# EAGLE design MAIN_AV_Final_2 (EAGLE 9.6.2)
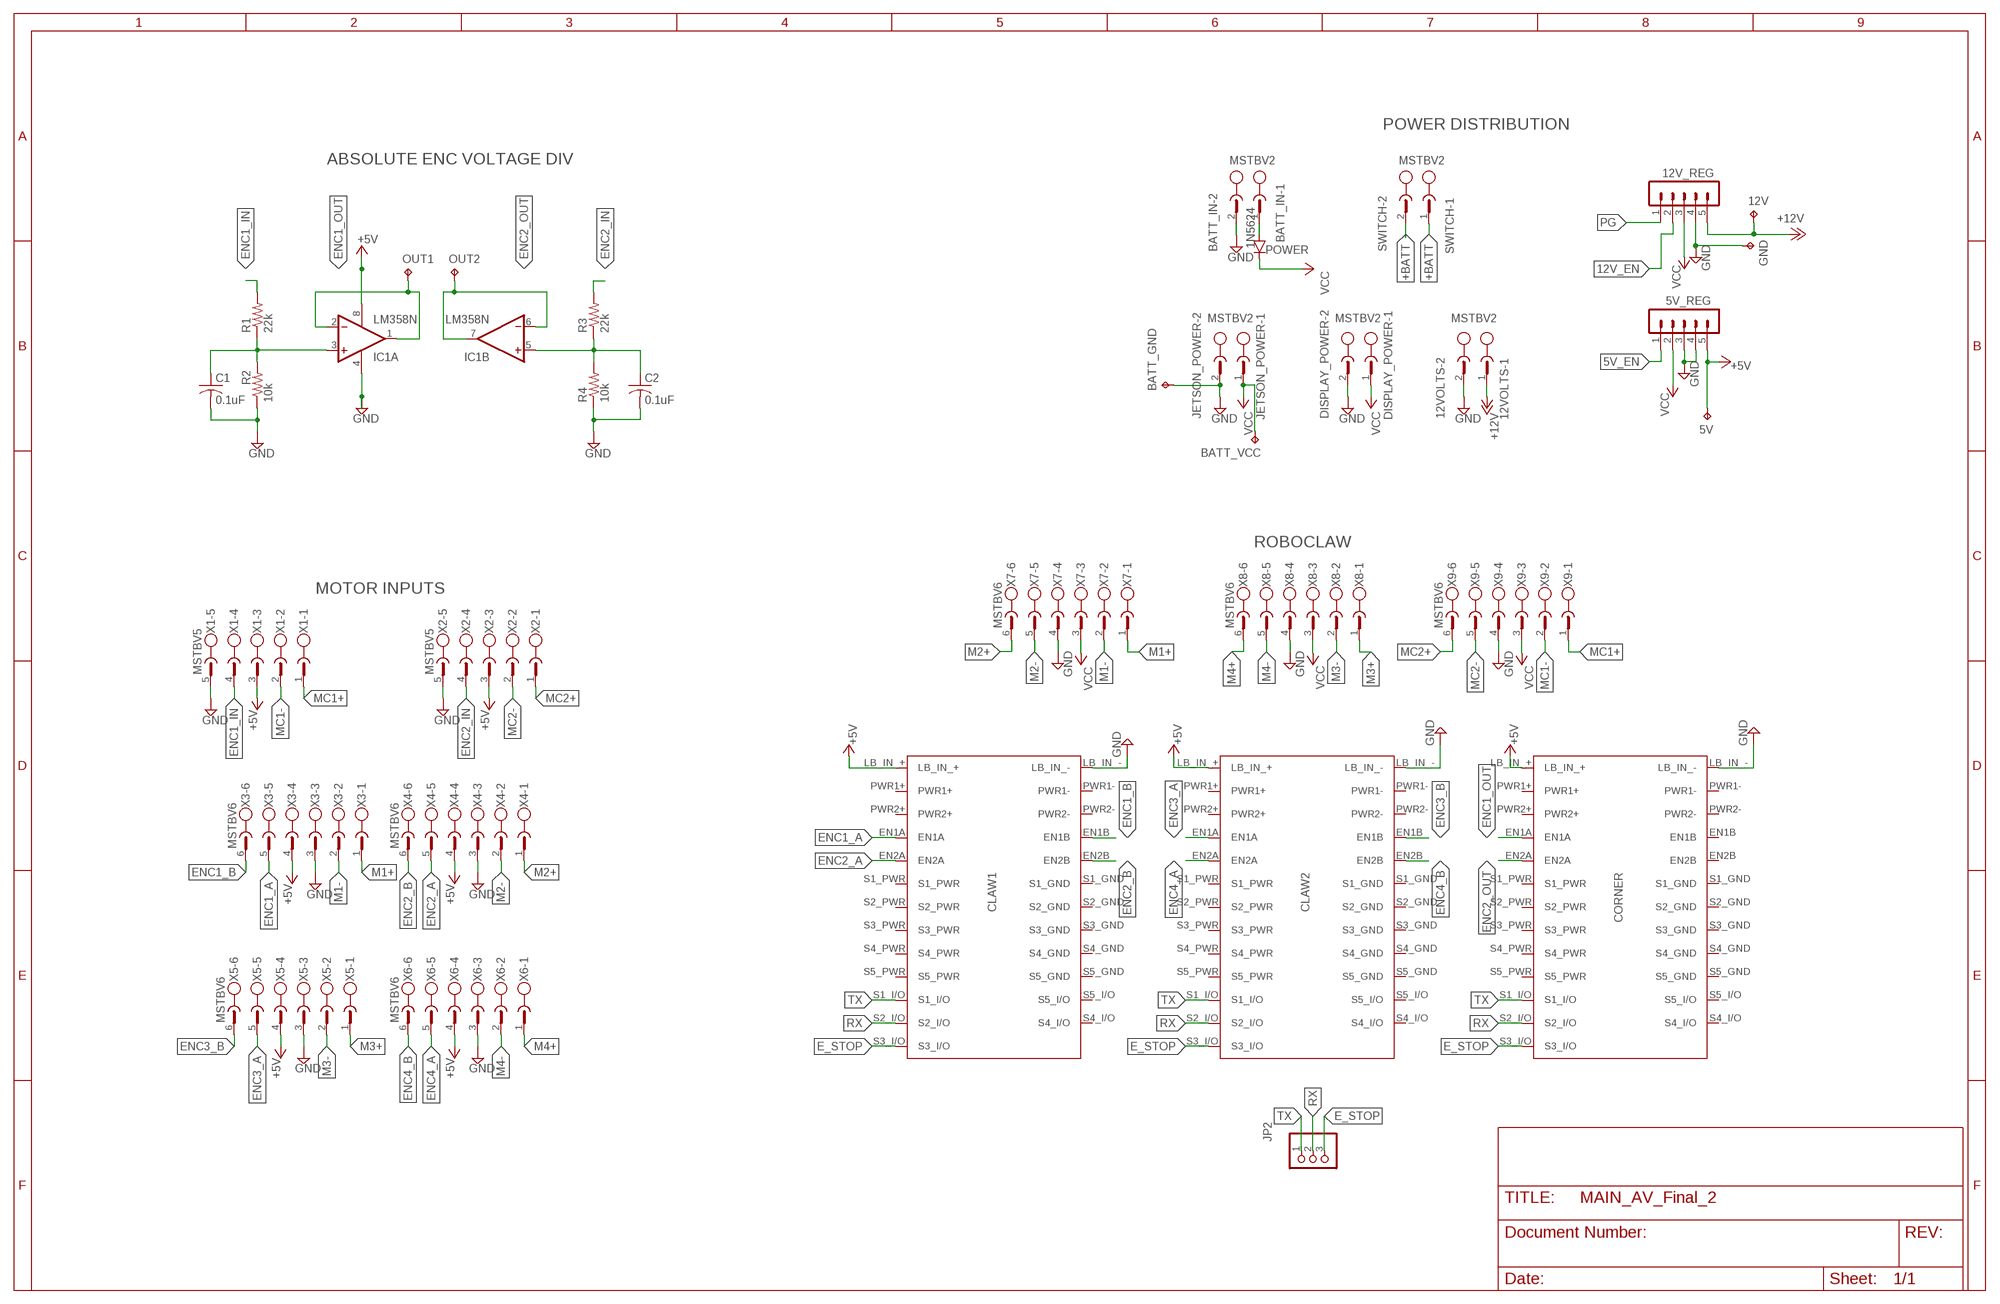
[diagram p0: schematic, sheet 1]

## Parts
5V  TPB1,27  [B1,27]
5V_REG  MA05-1  [MA05-1]
12V  TPB1,27  [B1,27]
12V_REG  MA05-1  [MA05-1]
12VOLTS  MSTBV2  [MSTBV2]
BATT_GND  TPB1,27  [B1,27]
BATT_IN  MSTBV2  [MSTBV2]
BATT_VCC  TPB1,27  [B1,27]
C1  0.1uF  C-US050-024X044  [C050-024X044]
C2  0.1uF  C-US050-024X044  [C050-024X044]
CLAW1  ROBOCLAW2X7A  [ROBOCLAW]
CLAW2  ROBOCLAW2X7A  [ROBOCLAW]
CORNER  ROBOCLAW2X7A  [ROBOCLAW]
DISPLAY_POWER  MSTBV2  [MSTBV2]
GND  TPB1,27  [B1,27]
IC1  LM358N  [DIL08]
JETSON_POWER  MSTBV2  [MSTBV2]
JP2  PINHD-1X3  [1X03]
OUT1  TPB1,27  [B1,27]
OUT2  TPB1,27  [B1,27]
POWER  1N5624  [DO201-15]
R1  22k  R-US_0204/7  [0204/7]
R2  10k  R-US_0204/7  [0204/7]
R3  22k  R-US_0204/7  [0204/7]
R4  10k  R-US_0204/7  [0204/7]
SWITCH  MSTBV2  [MSTBV2]
X1  MSTBV5  [MSTBV5]
X2  MSTBV5  [MSTBV5]
X3  MSTBV6  [MSTBV6]
X4  MSTBV6  [MSTBV6]
X5  MSTBV6  [MSTBV6]
X6  MSTBV6  [MSTBV6]
X7  MSTBV6  [MSTBV6]
X8  MSTBV6  [MSTBV6]
X9  MSTBV6  [MSTBV6]

## Nets
5V_EN: 5V_REG.1
12V_EN [12v_reg]: 12V_REG.2
+5V [power_5v]: 5V.TP 5V_REG.5 CLAW1.LB_IN_+ CLAW2.LB_IN_+ CORNER.LB_IN_+ IC1.8(P:V+) X1.3 X2.3 X3.4 X4.4 X5.4 X6.4
+12V [12v_reg]: 12V.TP 12V_REG.5 12VOLTS.1
+BATT [vcc]: SWITCH.1 SWITCH.2
E_STOP: CLAW1.S3_I/O CLAW2.S3_I/O CORNER.S3_I/O JP2.3
ENC1_A: CLAW1.EN1A X3.5
ENC1_B: CLAW1.EN1B X3.6
ENC1_IN: R1.2 X1.4
ENC1_OUT: CORNER.EN1A IC1.1(A:OUT) IC1.2(A:-IN) OUT1.TP
ENC2_A: CLAW1.EN2A X4.5
ENC2_B: CLAW1.EN2B X4.6
ENC2_IN: R3.2 X2.4
ENC2_OUT: CORNER.EN2A IC1.6(B:-IN) IC1.7(B:OUT) OUT2.TP
ENC3_A: CLAW2.EN1A X5.5
ENC3_B: CLAW2.EN1B X5.6
ENC4_A: CLAW2.EN2A X6.5
ENC4_B: CLAW2.EN2B X6.6
GND [vcc]: 5V_REG.3 5V_REG.4 12V_REG.4 12VOLTS.2 BATT_GND.TP BATT_IN.2 C1.2 C2.2 CLAW1.LB_IN_- CLAW2.LB_IN_- CORNER.LB_IN_- DISPLAY_POWER.2 GND.TP IC1.4(P:V-) JETSON_POWER.2 R2.1 R4.1 X1.5 X2.5 X3.3 X4.3 X5.3 X6.3 X7.4 X8.4 X9.4
M1+ [12v_reg]: X3.1 X7.1
M1- [12v_reg]: X3.2 X7.2
M2+ [12v_reg]: X4.1 X7.6
M2- [12v_reg]: X4.2 X7.5
M3+ [12v_reg]: X5.1 X8.1
M3- [12v_reg]: X5.2 X8.2
M4+ [12v_reg]: X6.1 X8.6
M4- [12v_reg]: X6.2 X8.5
MC1+ [12v_reg]: X1.1 X9.1
MC1- [12v_reg]: X1.2 X9.2
MC2+ [12v_reg]: X2.1 X9.6
MC2- [12v_reg]: X2.2 X9.5
N$1: C1.1 IC1.3(A:+IN) R1.1 R2.2
N$2: C2.1 IC1.5(B:+IN) R3.1 R4.2
N$3 [vcc]: BATT_IN.1 POWER.A
PG: 12V_REG.1
RX: CLAW1.S2_I/O CLAW2.S2_I/O CORNER.S2_I/O JP2.2
TX: CLAW1.S1_I/O CLAW2.S1_I/O CORNER.S1_I/O JP2.1
VCC [vcc]: 5V_REG.2 12V_REG.3 BATT_VCC.TP DISPLAY_POWER.1 JETSON_POWER.1 POWER.C X7.3 X8.3 X9.3
Unconnected: CLAW1.PWR1+ CLAW1.PWR1- CLAW1.PWR2+ CLAW1.PWR2- CLAW1.S1_GND CLAW1.S1_PWR CLAW1.S2_GND CLAW1.S2_PWR CLAW1.S3_GND CLAW1.S3_PWR CLAW1.S4_GND CLAW1.S4_I/O CLAW1.S4_PWR CLAW1.S5_GND CLAW1.S5_I/O CLAW1.S5_PWR CLAW2.PWR1+ CLAW2.PWR1- CLAW2.PWR2+ CLAW2.PWR2- CLAW2.S1_GND CLAW2.S1_PWR CLAW2.S2_GND CLAW2.S2_PWR CLAW2.S3_GND CLAW2.S3_PWR CLAW2.S4_GND CLAW2.S4_I/O CLAW2.S4_PWR CLAW2.S5_GND CLAW2.S5_I/O CLAW2.S5_PWR CORNER.EN1B CORNER.EN2B CORNER.PWR1+ CORNER.PWR1- CORNER.PWR2+ CORNER.PWR2- CORNER.S1_GND CORNER.S1_PWR CORNER.S2_GND CORNER.S2_PWR CORNER.S3_GND CORNER.S3_PWR CORNER.S4_GND CORNER.S4_I/O CORNER.S4_PWR CORNER.S5_GND CORNER.S5_I/O CORNER.S5_PWR

## Notes on the sheet
- POWER DISTRIBUTION
- ABSOLUTE ENC VOLTAGE DIV
- ROBOCLAW
- MOTOR INPUTS

## Library data of the parts
5V 12V BATT_GND BATT_VCC GND OUT1 OUT2 = testpad:TP: Test pad
5V_REG 12V_REG = con-lstb:MA05-1: PIN HEADER; OC_FARNELL: unknown; OC_NEWARK: unknown
12VOLTS BATT_IN DISPLAY_POWER JETSON_POWER SWITCH = con-phoenix-508:MSTBV2: PHOENIX; MPN: MSTBV 2,5/2-GF-5.08; OC_FARNELL: 1792792; OC_NEWARK: 69R9845
C1 C2 = rcl:C-US: CAPACITOR, American symbol; SPICEPREFIX: C
CLAW1 CLAW2 CORNER = Roboclaw_New:ROBOCLAW2X7A
IC1 = linear:LM358: OP AMP also LM158; LM258; LM2904 Source: http://cache.national.com/ds/LM/LM158.pdf
JP2 = pinhead:PINHD-1X3: PIN HEADER
POWER = diode:1N5624: DIODE controlled avalanche rectifier
R1-R4 = rcl:R-US_: RESISTOR, American symbol; SPICEPREFIX: R
X1 X2 = con-phoenix-508:MSTBV5: PHOENIX; MPN: MSTBV 2,5/5-GF-5.08; OC_FARNELL: 1792795; OC_NEWARK: 69R9848
X3-X9 = con-phoenix-508:MSTBV6: PHOENIX; MPN: MSTBV 2,5/6-GF-5.08; OC_FARNELL: 1792796; OC_NEWARK: 69R9849

## Net classes
0 default: width 0.254 mm
1 power_5v: width 0.254 mm
2 12v_reg: width 0.635 mm
3 vcc: width 0.762 mm

## Board
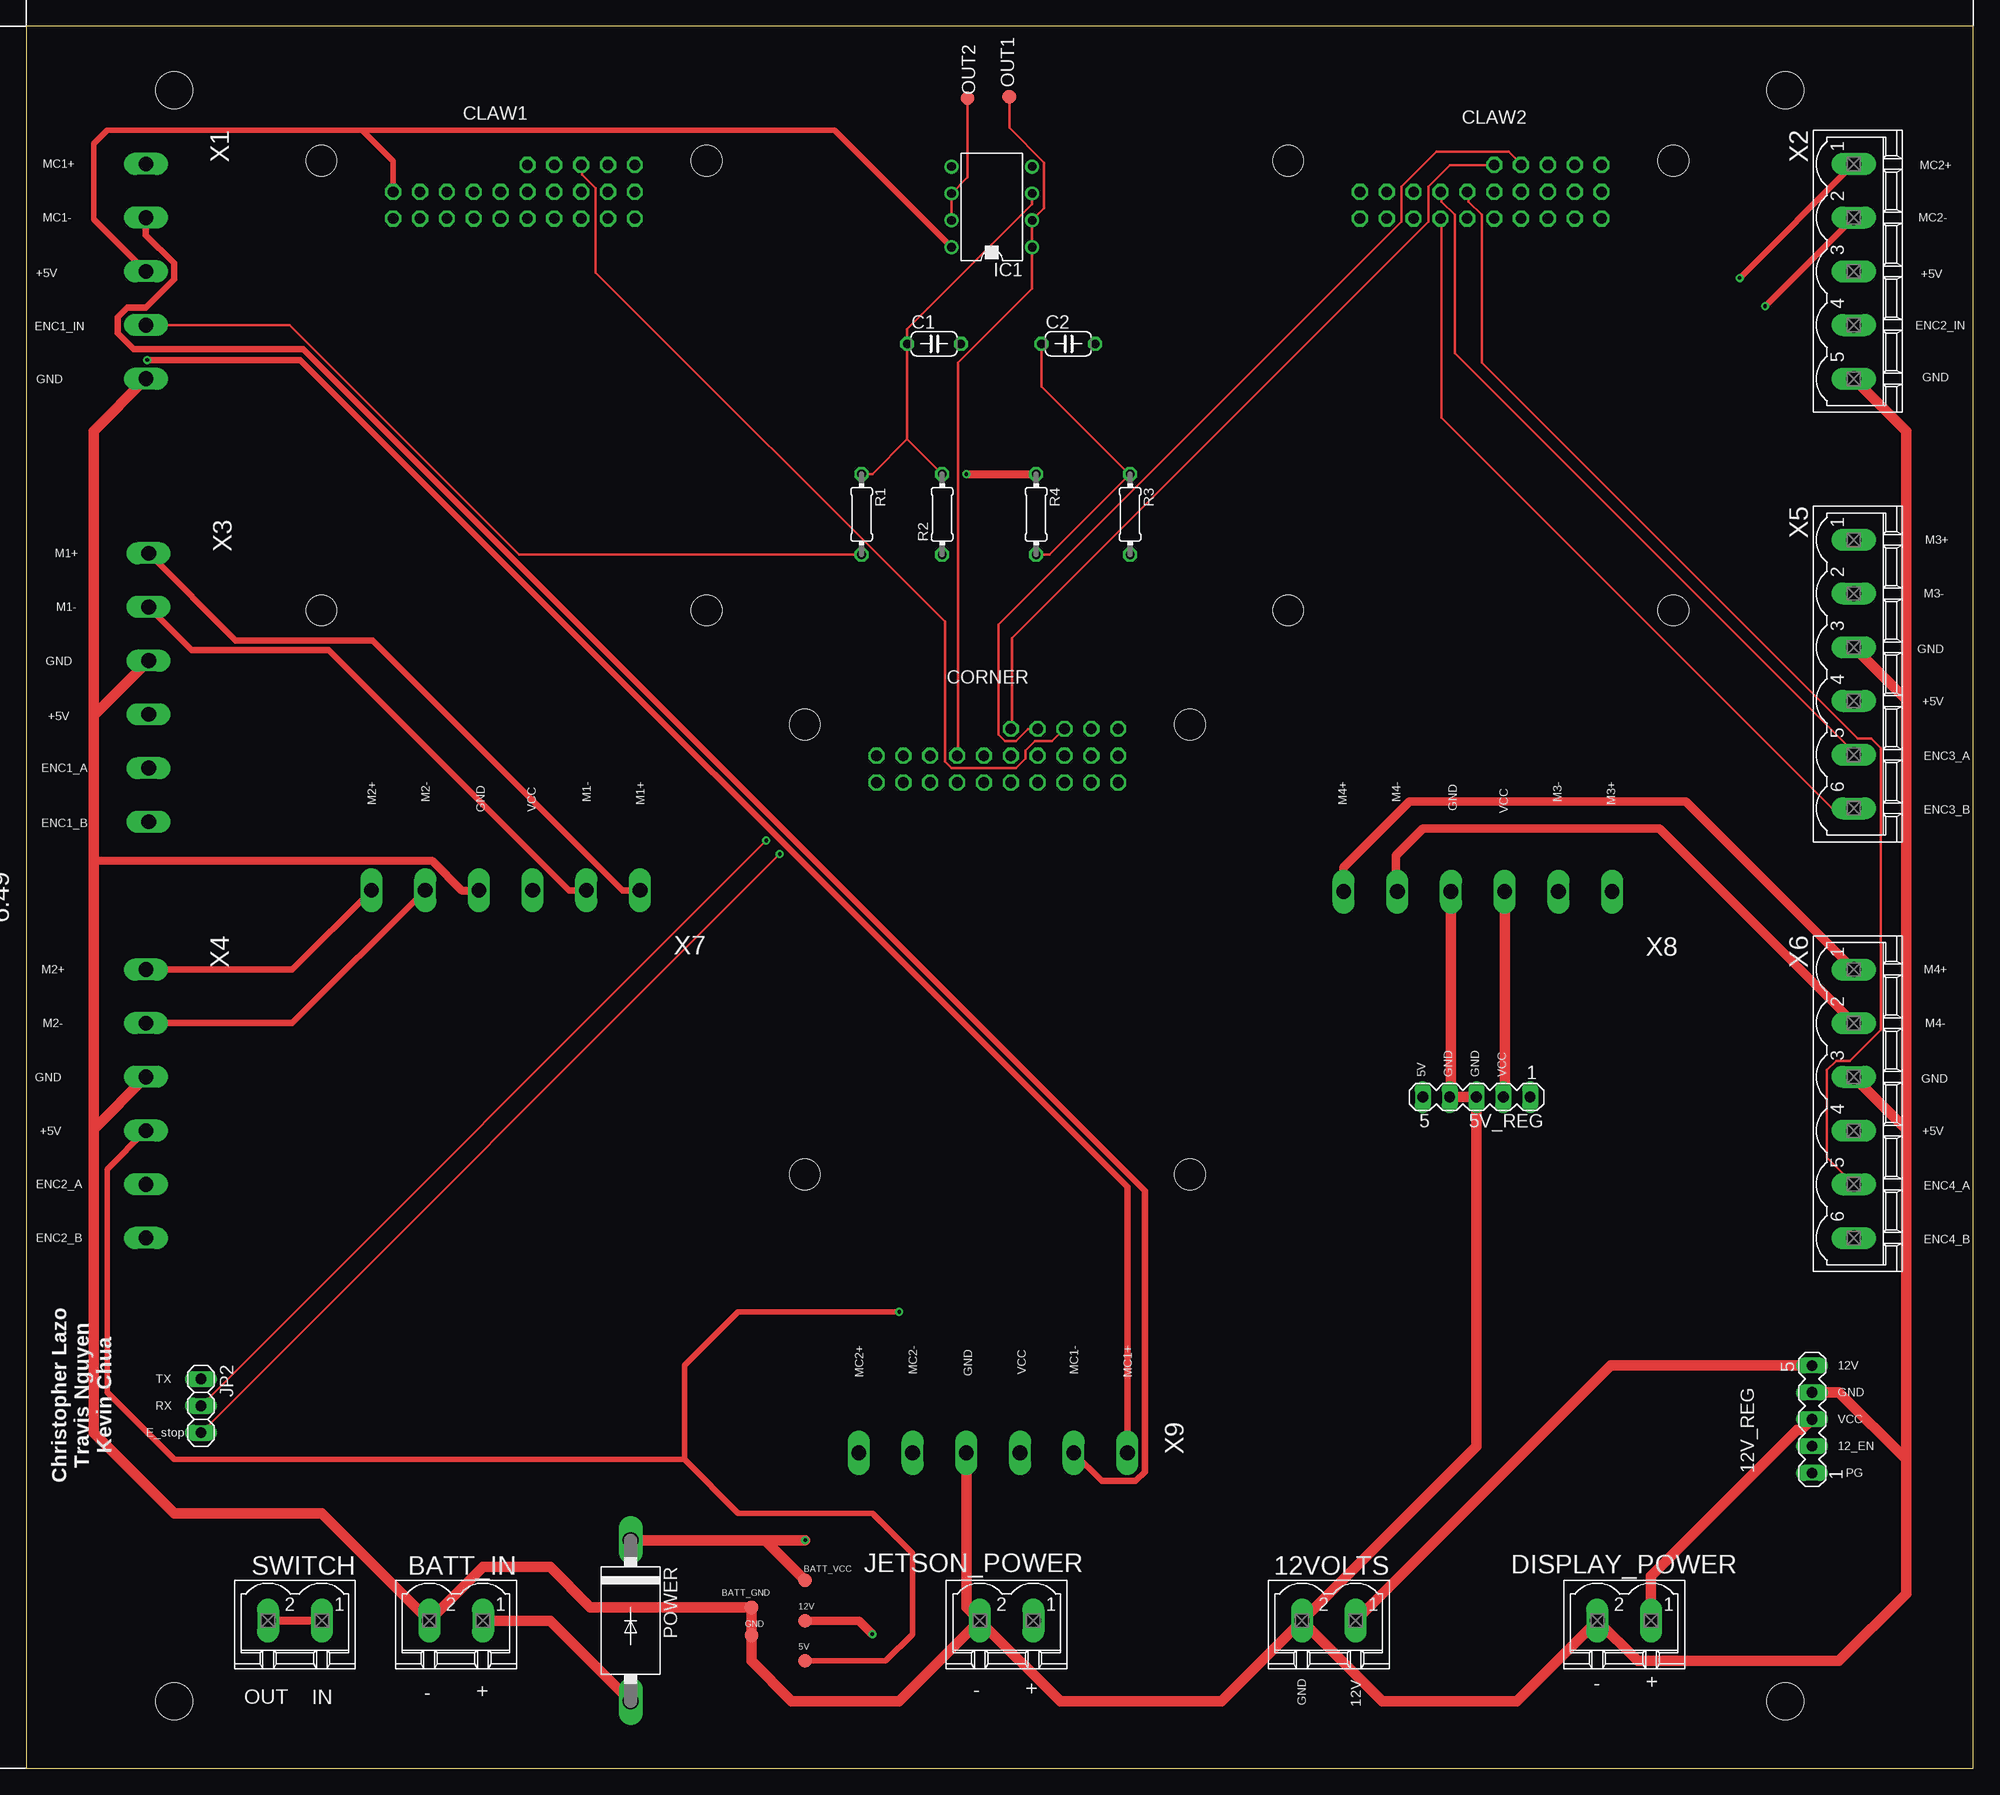
[diagram p1: board, top side]
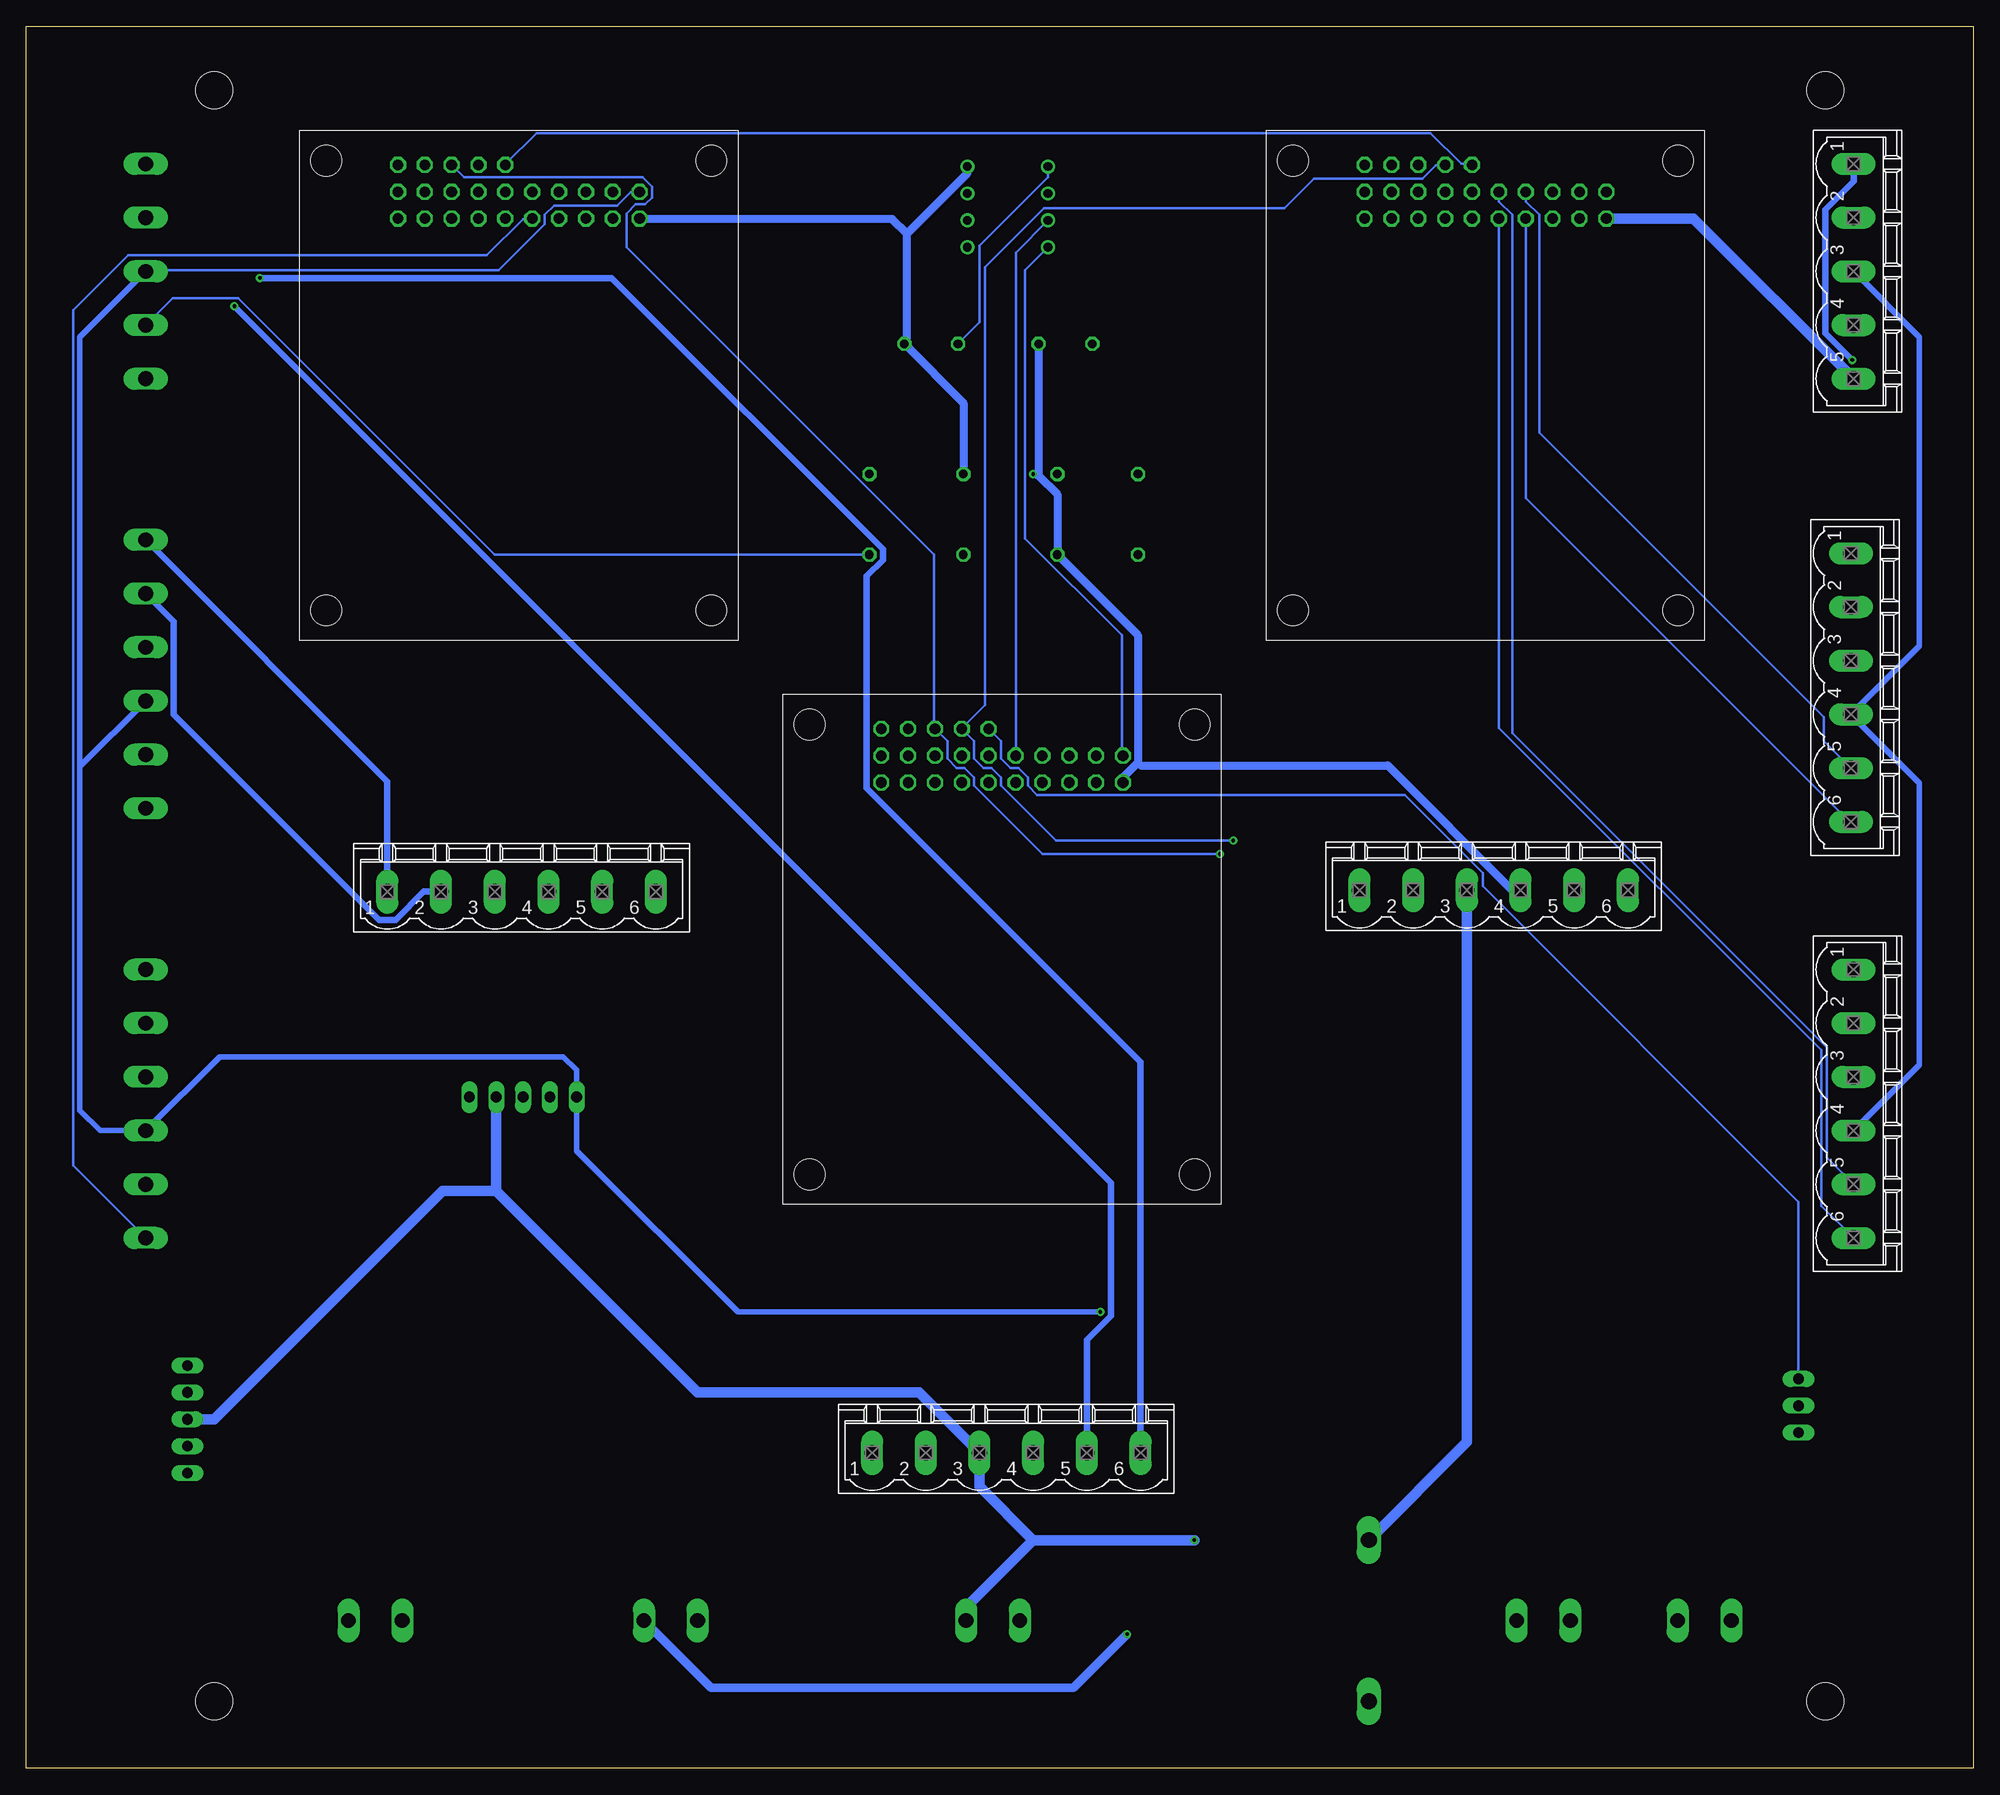
[diagram p2: board, bottom side, seen from below]

Size 184.13 x 164.77 mm. Coordinates in mm from the lower left corner, seen from the top.
Outline: 0,0 184.13,0 184.13,164.77 0,164.77 0,0
Copper layers (1*16): Top 0.035mm / dielectric 1.5mm / Bottom 0.035mm
Design rules "default *": minimum track width 10mil, minimum drill 0.35mm, track to track 10mil, track to pad 10mil, pad to pad 10mil, via to via 10mil, smd to smd 10mil, copper to edge 40mil, drill to drill 6mil, minimum pad ring 10mil, minimum via ring 8mil, stop-mask expansion 4mil, vias tented up to drill 0mil, thermal gap 10mil
Holes 3.5 mm at 13.97,158.75 166.37,158.75 13.97,6.35 166.37,6.35

### Footprints (pad centres in the part's own frame; a part is rotated, then mirrored left to right if it is on the bottom)
B1,27 = smd 1.27 x 1.27: TP 0,0
MA05-1 = drill 1.016 long: 1 -5.08,0; 2 -2.54,0; 3 0,0; 4 2.54,0; 5 5.08,0
MSTBV2 = drill 1.397 long: 1 -2.54,0; 2 2.54,0
C050-024X044 = drill 0.813 octagon: 1 -2.54,0; 2 2.54,0
ROBOCLAW = drill 1 octagon: EN1A 16.91,5.81; EN1B 16.91,8.35; EN2A 19.45,5.81; EN2B 19.45,8.35; LB_IN_+ 9.29,5.81; LB_IN_- 9.29,8.35; PWR1+ 11.83,5.81; PWR1- 11.83,8.35; PWR2+ 14.37,5.81; PWR2- 14.37,8.35; S1_GND 21.99,8.35; S1_I/O 21.99,3.27; S1_PWR 21.99,5.81; S2_GND 24.53,8.35; S2_I/O 24.53,3.27; S2_PWR 24.53,5.81; S3_GND 27.07,8.35; S3_I/O 27.07,3.27; S3_PWR 27.07,5.81; S4_GND 29.61,8.35; S4_I/O 29.61,3.27; S4_PWR 29.61,5.81; S5_GND 32.15,8.35; S5_I/O 32.15,3.27; S5_PWR 32.15,5.81 | hole 2.9: 2.5,2.87; 2.5,45.41; 38.94,45.41; 38.94,2.87
DIL08 = drill 0.813 pad 1.27: 1 -3.81,-3.81; 2 -1.27,-3.81; 3 1.27,-3.81; 4 3.81,-3.81; 5 3.81,3.81; 6 1.27,3.81; 7 -1.27,3.81; 8 -3.81,3.81
1X03 = drill 1.016 long: 1 -2.54,0; 2 0,0; 3 2.54,0
DO201-15 = drill 1.499 long: A 7.62,0; C -7.62,0
0204/7 = drill 0.813 octagon: 1 -3.81,0; 2 3.81,0
MSTBV5 = drill 1.397 long: 1 -10.16,0; 2 -5.08,0; 3 0,0; 4 5.08,0; 5 10.16,0
MSTBV6 = drill 1.397 long: 1 -12.7,0; 2 -7.62,0; 3 -2.54,0; 4 2.54,0; 5 7.62,0; 6 12.7,0

### Placement (x,y rotation side)
5V  73.66,10.16 0 top
5V_REG  137.16,63.5 180 top
12V  73.66,13.97 0 top
12V_REG  168.91,33.02 90 top
12VOLTS  123.19,13.97 180 top
BATT_GND  68.58,15.24 0 top
BATT_IN  40.64,13.97 180 top
BATT_VCC  73.66,17.78 0 top
C1  85.85,134.75 0 top
C2  98.55,134.75 0 top
CLAW1  25.4,154.94 180 bottom
CLAW2  116.84,154.94 180 bottom
CORNER  71.12,101.6 180 bottom
DISPLAY_POWER  151.13,13.97 180 top
GND  68.58,12.57 0 top
IC1  91.31,147.7 90 top
JETSON_POWER  92.71,13.97 180 top
JP2  16.51,34.29 270 top
OUT1  92.96,158.12 180 top
OUT2  89.03,157.99 180 top
POWER  57.15,13.97 270 top
R1  78.99,118.62 270 top
R2  86.61,118.62 90 top
R3  104.39,118.62 270 top
R4  95.5,118.62 270 top
SWITCH  25.4,13.97 180 top
X1  11.3,141.6 270 bottom
X2  172.85,141.6 270 top
X3  11.56,102.23 270 bottom
X4  11.3,62.87 270 bottom
X5  172.85,103.5 270 top
X6  172.85,62.87 270 top
X7  45.34,83.06 0 bottom
X8  137.29,82.93 0 bottom
X9  91.44,29.84 0 bottom

### Tracks (layer width: path | path; a pad name or v marks a point on that pad's centre or on a via)
+5V  (via drill 0.35)
  Top 0.508: 5V.TP 81.28,10.16 83.82,12.7 83.82,20.32 80.01,24.13 67.31,24.13 62.23,29.21 | 62.23,29.21 62.23,38.1 67.31,43.18 v82.55,43.18 | X1.3 6.35,146.56 6.35,153.67 7.62,154.94 31.75,154.94 | CLAW1.LB_IN_+ 34.69,152 31.75,154.94 | 31.75,154.94 76.45,154.94 IC1.8 | 62.23,29.21 13.97,29.21 7.62,35.56 7.62,56.64 X4.4
  Bottom 0.254: IC1.8 89.66,141.73 89.66,116.33 80.52,107.19 80.52,95.89 CORNER.LB_IN_+ | CLAW2.LB_IN_+ 126.24,149.1 127,149.1 128.27,147.83 134.24,147.83 135.13,146.94 135.13,146.05 139.45,141.73 172.72,141.73 X2.3
  Bottom 0.508: v82.55,43.18 116.84,43.18 132.08,58.42 5V_REG.5 132.08,66.04 133.35,67.31 165.86,67.31 X6.4 177.16,60.33 179.07,62.23 179.07,94.74 | 179.07,94.74 X5.4 | 179.07,94.74 179.07,135.38 X2.3 | X4.4 5.08,66.55 5.08,93.22 X3.4 5.08,106.17 5.08,135.38 X1.3
+12V  (via drill 0.35)
  Top 0.813: 12V.TP 78.74,13.97 v80.01,12.7
  Top 1.016: 12VOLTS.1 149.86,38.1 12V_REG.5
  Bottom 0.813: 12VOLTS.1 119.38,7.62 85.09,7.62 v80.01,12.7
+BATT
  Top 0.762: SWITCH.1 SWITCH.2
E_STOP  (via drill 0.35)
  Top 0.254: CLAW1.S3_I/O 52.58,151.64 52.58,150.75 53.85,149.48 53.85,141.48 86.87,108.46 86.87,95.25 87.5,94.61 93.6,94.61 94.49,95.5 94.49,96.27 95.38,97.16 97.03,97.16 98.17,98.3 CORNER.S3_I/O | v71.25,86.49 JP2.3
  Bottom 0.254: CLAW2.S3_I/O 143.89,151.64 142.75,150.5 125.86,150.5 124.97,149.61 124.97,148.59 125.6,147.96 126.49,147.96 127.38,147.07 127.38,143.89 98.3,114.81 98.3,98.42 CORNER.S3_I/O 98.17,98.3 97.03,97.16 97.03,95.5 96.14,94.61 95.38,94.61 94.49,93.73 94.49,92.96 88.01,86.49 v71.25,86.49
ENC1_A
  Bottom 0.254: X3.5 14.1,97.16 14.1,99.44 41.02,126.36 41.02,146.94 42.29,148.21 42.29,149.1 CLAW1.EN1A
ENC1_B
  Bottom 0.254: X3.6 11.68,89.53 42.29,120.14 42.29,146.56 CLAW1.EN1B
ENC1_IN
  Top 0.254: R1.2 46.61,114.81 24.89,136.53 X1.4
ENC1_OUT
  Top 0.254: OUT1.TP 92.96,155.19 96.27,151.89 96.27,147.57 IC1.2 IC1.1 95.12,139.95 88.14,132.97 88.14,95.89 CORNER.EN1A
ENC2_A
  Bottom 0.254: X4.5 13.84,57.78 13.84,68.2 43.56,97.92 43.56,146.94 44.83,148.21 44.83,149.1 CLAW1.EN2A
ENC2_B
  Bottom 0.254: X4.6 14.35,53.21 14.35,67.94 44.83,98.42 44.83,146.56 CLAW1.EN2B
ENC2_IN
  Bottom 0.254: R3.2 139.83,114.81 164.08,139.06 170.31,139.06 X2.4
ENC2_OUT
  Top 0.254: OUT2.TP 89.03,150.5 IC1.6 IC1.7
  Bottom 0.254: IC1.7 90.55,143.38 90.55,95.89 CORNER.EN2A
ENC3_A
  Top 0.254: X5.5 172.85,96.14 135.13,133.86 135.13,146.94 133.86,148.21 133.86,149.1 CLAW2.EN1A
ENC3_B
  Top 0.254: X5.6 170.81,90.81 133.86,127.76 133.86,146.56 CLAW2.EN1B
ENC4_A
  Top 0.254: X6.5 170.31,57.78 170.31,66.04 171.2,66.93 172.47,66.93 175.39,69.85 175.39,96.52 174.5,97.41 173.23,97.41 137.67,132.97 137.67,146.94 136.4,148.21 136.4,149.1 CLAW2.EN2A
ENC4_B
  Bottom 0.254: X6.6 179.71,57.02 179.71,137.92 174.5,143.13 140.59,143.13 137.16,146.56 136.4,146.56 CLAW2.EN2B
GND  (via drill 0.35)
  Top 0.762: X7.4 41.15,83.06 38.35,85.85 6.35,85.85 | v88.9,122.43 R4.1
  Top 1.016: JETSON_POWER.2 82.55,6.35 72.39,6.35 68.58,10.16 GND.TP BATT_GND.TP 53.34,15.24 49.53,19.05 43.18,19.05 BATT_IN.2 27.94,24.13 13.97,24.13 6.35,31.75 6.35,60.45 | JETSON_POWER.2 97.79,6.35 113.03,6.35 12VOLTS.2 | 12VOLTS.2 128.27,6.35 140.97,6.35 DISPLAY_POWER.2 152.4,10.16 171.45,10.16 177.8,16.51 177.8,29.21 | 177.8,29.21 171.45,35.56 12V_REG.4 | X6.3 177.8,60.45 | 177.8,29.21 177.8,60.45 | 177.8,60.45 177.8,101.09 | 177.8,101.09 X5.3 | X2.5 177.8,126.49 177.8,101.09 | JETSON_POWER.2 88.9,15.24 X9.4 | 12VOLTS.2 137.16,30.48 5V_REG.3 5V_REG.4 134.75,63.63 X8.4 | X4.3 6.35,60.45 | 6.35,99.57 X3.3 | 6.35,60.45 6.35,85.85 6.35,99.57 | 6.35,99.57 6.35,126.49 X1.5
  Bottom 0.762: R4.1 95.5,129.16 C2.2 100.84,135 100.84,145.16 | IC1.4 95.12,150.88 100.84,145.16 | 100.84,145.16 102.23,146.56 126.11,146.56 CLAW2.LB_IN_- | 88.39,122.3 86.61,120.52 R2.1 78.99,107.19 78.99,95.12 | C1.2 88.39,122.3 | 78.99,95.12 80.39,93.73 80.39,93.34 CORNER.LB_IN_- | X7.4 43.56,83.06 55.37,94.87 78.74,94.87 78.99,95.12 | v88.9,122.43 88.65,122.43 88.39,122.3
  Bottom 1.016: X1.5 26.45,146.59 CLAW1.LB_IN_-
M1+
  Top 0.635: X7.1 56.39,83.06 32.77,106.68 19.81,106.68 X3.1
M1-
  Top 0.635: X7.2 51.31,83.06 28.57,105.79 15.62,105.79 X3.2
M2+
  Top 0.635: X4.1 25.15,75.56 X7.6
M2-
  Top 0.635: X4.2 25.15,70.48 X7.5
M3+
  Bottom 0.635: X8.1 149.99,93.34 X5.1
M3-
  Bottom 0.635: X8.2 146.56,82.93 149.22,80.26 150.75,80.26 170.18,99.69 170.18,108.46 X5.2
M4+
  Top 0.813: X6.1 156.97,91.44 130.81,91.44 124.59,85.22 X8.6
M4-
  Top 0.813: X8.5 129.54,83.06 129.54,86.36 132.08,88.9 154.43,88.9 X6.2
MC1+  (via drill 0.35)
  Top 0.635: v11.43,133.22 25.91,133.22 104.14,54.99 X9.1
  Bottom 0.635: X1.1 11.3,150.11 13.97,147.45 13.97,135.76 v11.43,133.22
MC1-
  Top 0.635: X1.2 11.3,145.03 13.97,142.37 13.97,140.84 11.3,138.18 9.53,138.18 8.64,137.29 8.64,135.76 10.16,134.24 26.16,134.24 105.79,54.61 105.79,28.07 104.9,27.18 101.73,27.18 X9.2
MC2+  (via drill 0.35)
  Top 0.635: X2.1 v162.05,140.97
  Bottom 0.635: X9.6 78.74,66.8 104.65,92.71 104.65,112.78 103.12,114.3 103.12,115.32 128.78,140.97 v162.05,140.97
MC2-  (via drill 0.35)
  Top 0.635: X2.2 v164.47,138.3
  Bottom 0.635: X9.5 83.82,40.51 81.53,42.8 81.53,55.37 v164.47,138.3
N$1
  Top 0.254: IC1.3 95.12,147.96 83.31,136.14 C1.1 83.31,125.73 | 83.31,125.73 R2.2 | R1.1 80.01,122.43 83.31,125.73
N$2
  Top 0.254: R4.2 96.77,114.81 R3.1 104.27,122.43 96.01,130.68 C2.1
  Bottom 0.254: IC1.5 87.5,150.5 93.98,144.02 93.98,136.78 C2.1
N$3
  Top 1.016: BATT_IN.1 49.53,13.97 POWER.A
RX  (via drill 0.35)
  Top 0.254: CORNER.S2_I/O 95.63,98.3 94.74,98.3 93.6,97.16 92.58,97.16 91.95,97.79 91.95,108.2 130.05,146.3 130.05,149.61 133.35,152.91 140.21,152.91 141.35,151.76 CLAW2.S2_I/O | v69.98,87.76 JP2.2
  Bottom 0.254: CLAW1.S2_I/O 50.04,151.64 50.8,151.64 52.07,150.37 62.36,150.37 65.15,147.57 87.88,147.57 93.47,141.99 93.47,100.58 95.63,98.42 CORNER.S2_I/O 95.63,98.3 94.49,97.16 94.49,95.5 93.6,94.61 92.84,94.61 91.95,93.73 91.95,92.96 86.74,87.76 v69.98,87.76
TX
  Top 0.254: CORNER.S1_I/O 93.22,98.42 93.22,106.93 132.59,146.3 132.59,149.61 134.62,151.64 138.81,151.64 CLAW2.S1_I/O
  Bottom 0.254: CLAW1.S1_I/O 47.5,151.76 48.39,151.76 51.31,154.69 135.89,154.69 138.81,151.76 CLAW2.S1_I/O | JP2.1 16.51,53.59 46.35,83.44 46.35,84.71 53.72,92.08 88.52,92.08 89.41,92.96 89.41,93.73 90.3,94.61 91.06,94.61 91.95,95.5 91.95,97.16 93.09,98.3 CORNER.S1_I/O
VCC  (via drill 0.35)
  Top 1.016: BATT_VCC.TP 69.85,21.59 | 69.85,21.59 POWER.C | v73.66,21.59 69.85,21.59 | 12V_REG.3 167.89,32 167.52,32 153.67,18.16 DISPLAY_POWER.1 | X8.3 139.83,63.63 5V_REG.2
  Bottom 1.016: JETSON_POWER.1 95.25,15.24 88.9,21.59 | 88.9,21.59 v73.66,21.59 | 88.9,21.59 93.98,26.67 X9.3 99.69,35.56 120.65,35.56 139.7,54.61 | 139.7,54.61 5V_REG.2 | 12V_REG.3 166.37,33.02 144.78,54.61 139.7,54.61 | POWER.C 47.88,30.86 X7.3

### Text on the board
tNames: MC1+ | MC2+ | MC1- | MC2- | +5V | +5V | ENC2_IN | ENC1_IN | GND | GND | M3+ | M1+ | M3- | M1- | GND | GND | +5V | +5V | ENC3_A | ENC1_A | M2+ | M2- | GND | VCC | M1- | M1+ | M4+ | M4- | GND | VCC | M3- | M3+ | ENC3_B | ENC1_B | M2+ | M4+ | M2- | M4- | GND | GND | 5V | GND | GND | VCC | +5V | +5V | ENC2_A | ENC4_A | ENC2_B | ENC4_B | MC2+ | MC2- | GND | VCC | MC1- | MC1+ | 12V | TX | Christopher Lazo / Travis Nguyen / Kevin Chua | GND | RX | VCC | E_stop | 12_EN | PG | 12V | + | IN | + | - | + | - | OUT | - | GND